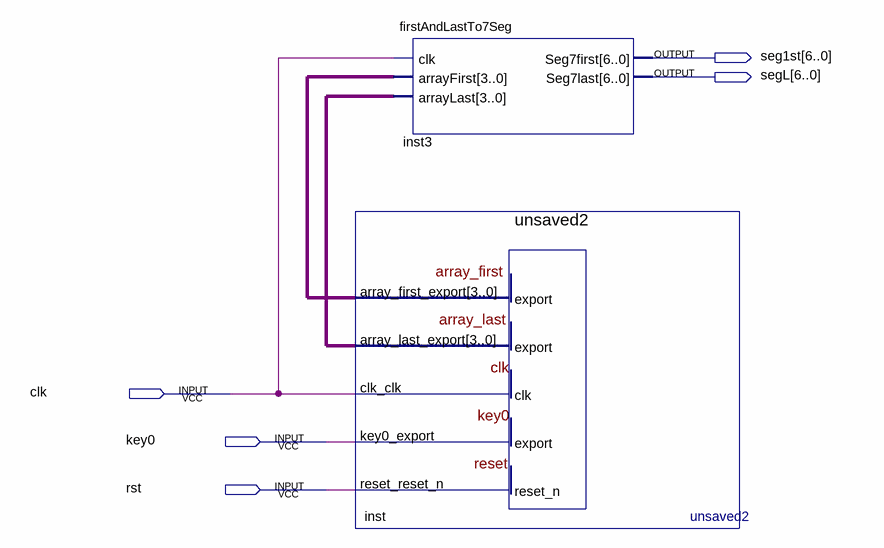
[diagram p0: schematic sheet]
// Quartus schematic Block2.bdf as structural Verilog: 2 symbols, 5 pins
module Block2 (
  input  clk,
  input  key0,
  input  rst,
  output [6:0] seg1st,
  output [6:0] segL
);

  wire [3:0] inst_array_first_export, inst_array_last_export;

  firstAndLastTo7Seg inst3 (
    .clk(clk), .arrayFirst(inst_array_first_export), .arrayLast(inst_array_last_export), .Seg7first(seg1st),
    .Seg7last(segL));
  unsaved2 inst (
    .clk_clk(clk), .key0_export(key0), .reset_reset_n(rst), .array_first_export(inst_array_first_export),
    .array_last_export(inst_array_last_export));
endmodule
